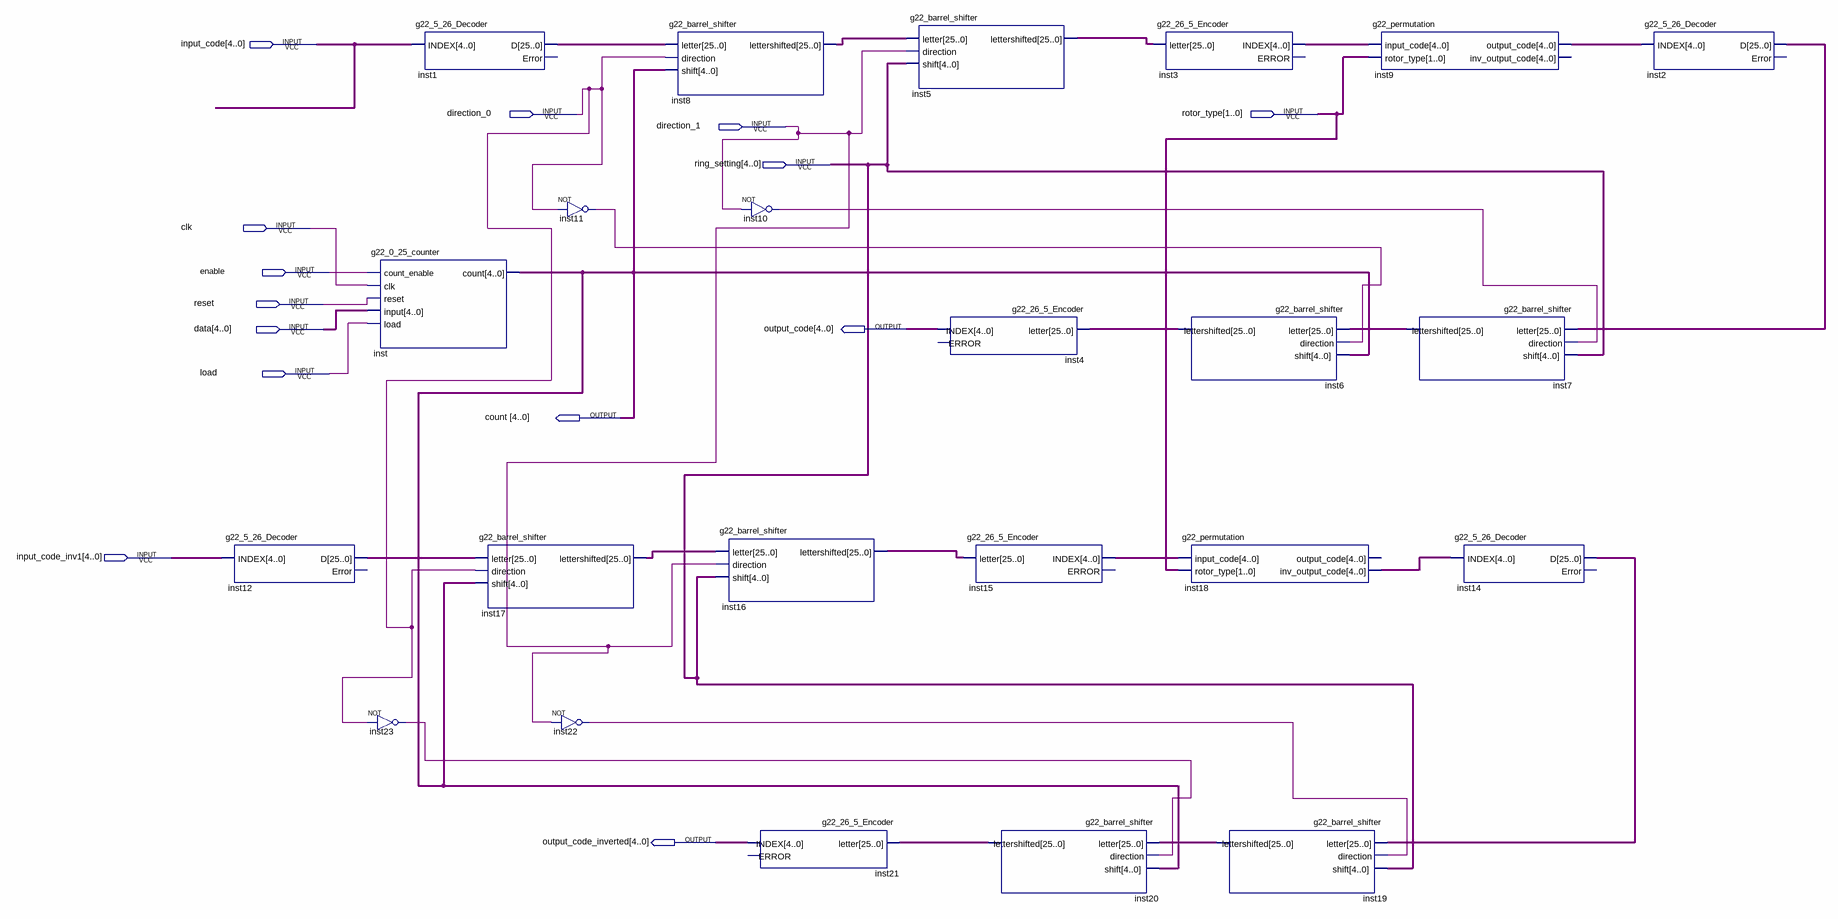
[diagram p0: schematic sheet]
// Quartus schematic g22_rotor_R.bdf as structural Verilog: 23 symbols, 14 pins
module g22_rotor_R (
  input  [4:0] input_code,
  input  direction_0,
  input  [1:0] rotor_type,
  input  direction_1,
  input  [4:0] ring_setting,
  input  clk,
  input  enable,
  input  reset,
  input  [4:0] data,
  input  load,
  input  [4:0] input_code_inv1,
  output [4:0] output_code,
  output [4:0] count,
  output [4:0] output_code_inverted
);

  wire inst10_out, inst11_out, inst22_out, inst23_out;
  wire [4:0] inst3_index, inst9_output_code, inst15_index, inst18_inv_output_code;
  wire [25:0] inst1_d, inst2_d, inst5_lettershifted, inst6_lettershifted, inst7_lettershifted,
       inst8_lettershifted, inst12_d, inst14_d, inst16_lettershifted, inst17_lettershifted,
       inst19_lettershifted, inst20_lettershifted;

  g22_5_26_Decoder inst12 (.INDEX(input_code_inv1), .D(inst12_d));  // open: Error
  g22_0_25_counter inst (.count_enable(enable), .clk(clk), .reset(reset), .\input (data), .load(load), .count(count));
  not inst23 (inst23_out, direction_0);
  g22_5_26_Decoder inst1 (.INDEX(input_code), .D(inst1_d));  // open: Error
  g22_barrel_shifter inst17 (
    .letter(inst12_d), .direction(direction_0), .shift(count), .lettershifted(inst17_lettershifted));
  not inst11 (inst11_out, direction_0);
  not inst22 (inst22_out, direction_1);
  g22_barrel_shifter inst8 (
    .letter(inst1_d), .direction(direction_0), .shift(count), .lettershifted(inst8_lettershifted));
  not inst10 (inst10_out, direction_1);
  g22_barrel_shifter inst16 (
    .letter(inst17_lettershifted), .direction(direction_1), .shift(ring_setting),
    .lettershifted(inst16_lettershifted));
  g22_26_5_Encoder inst21 (.letter(inst20_lettershifted), .INDEX(output_code_inverted));  // open: ERROR
  g22_barrel_shifter inst5 (
    .letter(inst8_lettershifted), .direction(direction_1), .shift(ring_setting),
    .lettershifted(inst5_lettershifted));
  g22_26_5_Encoder inst4 (.letter(inst6_lettershifted), .INDEX(output_code));  // open: ERROR
  g22_26_5_Encoder inst15 (.letter(inst16_lettershifted), .INDEX(inst15_index));  // open: ERROR
  g22_barrel_shifter inst20 (
    .letter(inst19_lettershifted), .direction(inst23_out), .shift(count), .lettershifted(inst20_lettershifted));
  g22_26_5_Encoder inst3 (.letter(inst5_lettershifted), .INDEX(inst3_index));  // open: ERROR
  g22_barrel_shifter inst6 (
    .letter(inst7_lettershifted), .direction(inst11_out), .shift(count), .lettershifted(inst6_lettershifted));
  g22_permutation inst18 (
    .input_code(inst15_index), .rotor_type(rotor_type), .inv_output_code(inst18_inv_output_code));  // open: output_code
  g22_barrel_shifter inst19 (
    .letter(inst14_d), .direction(inst22_out), .shift(ring_setting), .lettershifted(inst19_lettershifted));
  g22_permutation inst9 (
    .input_code(inst3_index), .rotor_type(rotor_type), .output_code(inst9_output_code));  // open: inv_output_code
  g22_barrel_shifter inst7 (
    .letter(inst2_d), .direction(inst10_out), .shift(ring_setting), .lettershifted(inst7_lettershifted));
  g22_5_26_Decoder inst14 (.INDEX(inst18_inv_output_code), .D(inst14_d));  // open: Error
  g22_5_26_Decoder inst2 (.INDEX(inst9_output_code), .D(inst2_d));  // open: Error
endmodule
